# Altium schematic sheet LED0805_v1.0.SchDoc
size A
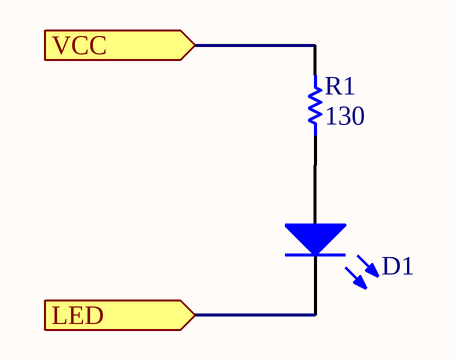
[diagram p0: LED0805_v1.0.SchDoc]

## Parts
D1  LED - NORMAL LED  [LED-0805 BLUE]  (value not drawn)
R1  value 130  [RS-0603]  (hidden comment: RS - RESISTOR)

## Ports
LED (in), VCC (in)

## Nets
LED: D1.K ; port LED
VCC: R1.2 ; port VCC
NetD1_A: D1.A R1.1

## Library data of the parts
R1 = RS - RESISTOR: TOLERANCE: RES TOL; POWER: RES POWER; Supplier Part Number 1: RHM150CFCT-ND; Supplier 1: *; (FIELD A): *; (FLIED C): *; (FIELD B): *; Manufacturer: *
D1 = LED - NORMAL LED: FORWARS VOLTAGE: *; CURRENT: *; COLOR: *; Supplier Part Number 1: VAOL-S6SB4CT-ND; Supplier 1: *; (FIELD B): *; (FIELD A): *; (FIELD C): *; Manufacturer: *